# EAGLE design McPiFace-Environment-V2 (EAGLE 7.4.0)
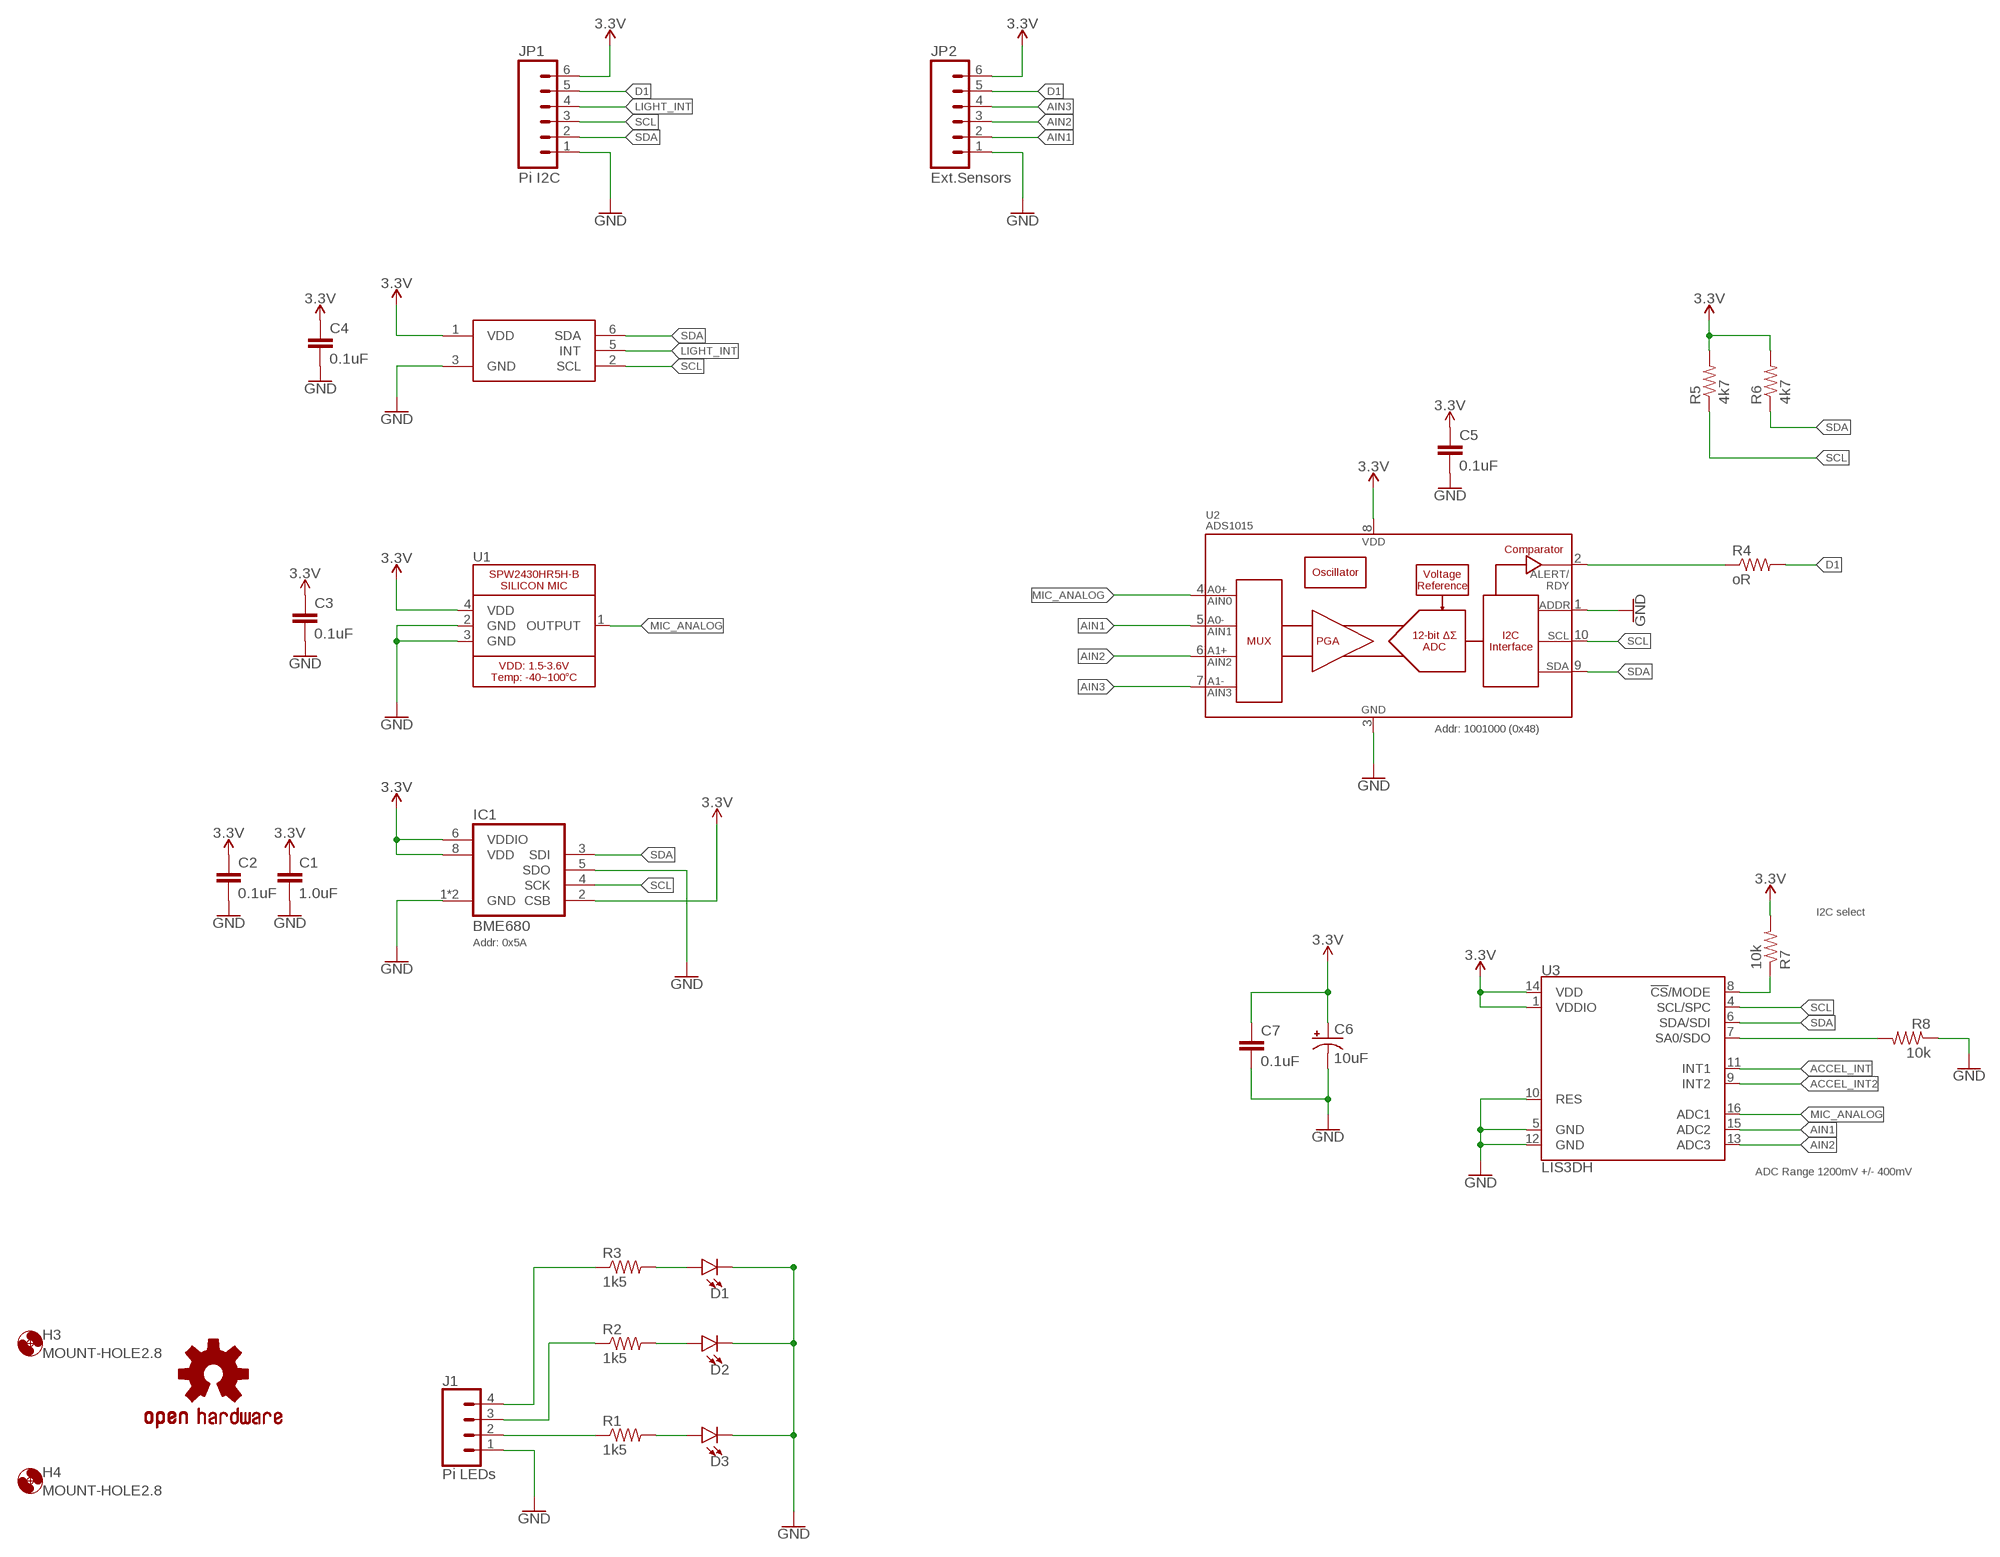
[diagram p0: schematic, sheet 1]

## Parts
C1  1.0uF  CAP0805  [0805]
C2  0.1uF  CAP0805  [0805]
C3  0.1uF  CAP0805  [0805]
C4  0.1uF  CAP0805  [0805]
C5  0.1uF  CAP0805  [0805]
C6  10uF  10UF-16V-10%(TANT)  [EIA3216]
C7  0.1uF  CAP0805  [0805]
D1  LED1206-BOTTOM-1.6MM  [LED-1206-BOTTOM-1.6MM]
D2  LED1206-BOTTOM-1.6MM  [LED-1206-BOTTOM-1.6MM]
D3  LED1206-BOTTOM-1.6MM  [LED-1206-BOTTOM-1.6MM]
H3  MOUNT-HOLE2.8  [2,8]
H4  MOUNT-HOLE2.8  [2,8]
IC1  BME680  [BME680]
J1  Pi LEDs  CONN_04SMD2  [1X04_1MM_RA]
JP1  Pi I2C  M06SMD-1MM  [1X06-1MM]
JP2  Ext.Sensors  M06SMD-1MM  [1X06-1MM]
LOGO1  OSHW-LOGOL  [OSHW-LOGO-L]
R1  1k5  RESISTOR0805-RES  [0805]
R2  1k5  RESISTOR0805-RES  [0805]
R3  1k5  RESISTOR0805-RES  [0805]
R4  oR  RESISTOR0805-RES  [0805]
R5  4k7  RESISTOR0805-RES  [0805]
R6  4k7  RESISTOR0805-RES  [0805]
R7  10k  RESISTOR0805-RES  [0805]
R8  10k  RESISTOR0805-RES  [0805]
U1  SPW2430HR5H-B  [SPW2430HR5H-B]
U2  ADS1015  [MSOP10]
U3  LIS3DH  [LGA-16-3X3]
U$1  TCS3472  [FN-6]

## Nets
3.3V: C1.1 C2.1 C3.1 C4.1 C5.1 C6.A(+) C7.1 IC1.2(CSB) IC1.6(VDDIO) IC1.8(VDD) JP1.6 JP2.6 R5.2 R6.2 R7.2 U1.4(VDD) U2.8(VDD) U3.1(VDDIO) U3.14(VDD) U$1.1(VDD)
ACCEL_INT: U3.11(INT1)
ACCEL_INT2: U3.9(INT2)
AIN1: JP2.2 U2.5(AIN1) U3.15(ADC2)
AIN2: JP2.3 U2.6(AIN2) U3.13(ADC3)
AIN3: JP2.4 U2.7(AIN3)
ALERT: R4.1 U2.2(ALERT/RDY)
D1: JP1.5 JP2.5 R4.2
GND: C1.2 C2.2 C3.2 C4.2 C5.2 C6.C(-) C7.2 D1.C D2.C D3.C IC1.1(GND) IC1.5(SDO) IC1.7(GND) J1.1 JP1.1 JP2.1 R8.1 U1.2(GND) U1.3(GND) U2.1(ADDR) U2.3(VSS) U3.5(GND) U3.10(RES) U3.12(GND) U$1.3(GND)
LIGHT_INT: JP1.4 U$1.5(INT)
MIC_ANALOG: U1.1(OUTPUT) U2.4(AIN0) U3.16(ADC1)
N$2: D1.A R3.2
N$3: D2.A R2.2
N$4: D3.A R1.2
N$5: J1.2 R1.1
N$6: J1.3 R2.1
N$7: J1.4 R3.1
N$14: R8.2 U3.7(SA0/SDO)
N$15: R7.1 U3.8(!CS!/MODE)
SCL: IC1.4(SCK) JP1.3 R5.1 U2.10(SCL) U3.4(SCL/SPC) U$1.2(SCL)
SDA: IC1.3(SDI) JP1.2 R6.1 U2.9(SDA) U3.6(SDA/SDI) U$1.6(SDA)

## Notes on the sheet
- Addr: 1001000 (0x48)
- I2C select
- Addr: 0x5A
- ADC Range 1200mV +/- 400mV

## Library data of the parts
C1-C5 C7 = SparkFun-Capacitors:CAP: Capacitor Standard 0603 ceramic capacitor, and 0.1" leaded capacitor.
C6 = SparkFun-Capacitors:10UF-16V-10%(TANT): CAP-00811 1206/EIA-3216 Tantalum capacitor; PROD_ID: CAP-00811
D1-D3 = ThingySticks:LED: LED (Generic) Standard schematic elements and footprints for 5mm, 3mm, 1206, and 0603 sized LEDs. Generic LEDs with no color specified.
H3 H4 = holes:MOUNT-HOLE: MOUNTING HOLE with drill center marker
IC1 = ThingySticks:BME680: BME680 integrates for the first time individual high linearity and high accuracy sensors for gas, pressure, humidity and temperature. The library has been designed by Richard Magdycz <https://www.facebook.com/groups/eaglecadsoftUK> Original version had pins in incorrect places (BME680 uses untypical clockwise direction). Updated 17 Feb 2018 S.Harrison ThingySticks.com
J1 = SparkFun-Connectors:CONN_04: Multi connection point. Often used as Generic Header-pin footprint for 0.1 inch spaced/style header connections On any of the 0.1 inch spaced packages, you can populate with these: Break Away Headers - Straight <https://www.sparkfun.com/products/116> (PRT-00116) Break Away Male Headers - Right Angle <https://www.sparkfun.com/products/553> (PRT-00553) Female Headers <https://www.sparkfun.com/products/115> (PRT-00115) Break Away Headers - Machine Pin <https://www.sparkfun.com/products/117> (PRT-00117) Break Away Female Headers - Swiss Machine Pin <https://www.sparkfun.com/products/743> (PRT-00743) For SCREWTERMINALS and SPRING TERMINALS visit here: Screw Terimnals on SparkFun.com <https://www.sparkfun.com/search/results?term=Screw+Terminals> (5mm/3.5mm/2.54mm spacing) This device is also useful as a general connection point to wire up your design to another part of your project. Our various solder wires solder well into these plated through hole pads. Hook-Up Wire - Assortment (Stranded, 22 AWG) <https://www.sparkfun.com/products/11375> (PRT-11375) Hook-Up Wire - Assortment (Solid Core, 22 AWG) <https://www.sparkfun.com/products/11367> (PRT-11367) View the entire wire category on our website here <https://www.sparkfun.com/categories/141> Special notes: Molex polarized connector foot print use with SKU : PRT-08231 with associated crimp pins and housings. 1MM SMD Version SKU: PRT-10208; PROD_ID: CONN-10310; SF_ID: PRT-10208
JP1 JP2 = SparkFun-Connectors:M06: Header 6 Standard 6-pin 0.1" header. Use with straight break away headers (SKU : PRT-00116), right angle break away headers (PRT-00553), swiss pins (PRT-00743), machine pins (PRT-00117), and female headers (PRT-00115). Molex polarized connector foot print use with SKU : PRT-08094 with associated crimp pins and housings. NOTES ON THE VARIANTS LOCK and LOCK_LONGPADS... This footprint was designed to help hold the alignment of a through-hole component (i.e. 6-pin header) while soldering it into place. You may notice that each hole has been shifted either up or down by 0.005 of an inch from it's more standard position (which is a perfectly straight line). This slight alteration caused the pins (the squares in the middle) to touch the edges of the holes. Because they are alternating, it causes a "brace" to hold the component in place. 0.005 has proven to be the perfect amount of "off-center" position when using our standard breakaway headers. Although looks a little odd when you look at the bare footprint, once you have a header in there, the alteration is very hard to notice. Also,if you push a header all the way into place, it is covered up entirely on the bottom side. This idea of altering the position of holes to aid alignment will be further integrated into the Sparkfun Library for other footprints. It can help hold any component with 3 or more connection pins.
LOGO1 = SparkFun-Aesthetics:OSHW-LOGO: Open-Source Hardware (OSHW) Logo This logo indicates the piece of hardware it is found on incorporates a OSHW license and/or adheres to the definition of open source hardware found here: http://freedomdefined.org/OSHW
R1-R8 = SparkFun-Resistors:RESISTOR: Resistor Basic schematic elements and footprints for 0603, 1206, and PTH resistors.
U1 = microbuilder:SPW2430HR5H-B: SPW2430HR5H-B - Silicon Microphone
U2 = SparkFun-AnalogIC:ADS1015: 12-Bit Del-Sig ADC Four single-ended inputs or two differential inputs Internal PGA I2C interface 2.0-5.5V; PROD_ID: IC-12239
U3 = SparkFun-Sensors:LIS3DH: ST Microelectronics LIS3DH 3-Axis ±2/4/8/16g SPI/I2C Accelerometer The LIS3DH is a three axis MEMS linear accelerometer in the "nano" family. It has a digital I2C/SPI serial interface which makes it ideal for using in embedded applications. The device also features ultra low-power operational modes that allow advanced power saving and smart sleep to wake-up functions, built in detections with interrupts, and auxiliary ADC inputs Datasheet-XXXX <http://www.sparkfun.com/datasheets/Sensors/Accelerometer/LIS3DH.pdf> SparkFun Products SparkFun Triple Axis Accelerometer Breakout - LIS3DH <https://www.sparkfun.com/products/10345> (SEN-XXXXX) Triple Axis Accelerometer - LIS3DH <https://www.sparkfun.com/products/9755> (SEN-XXXXX); PROD_ID: IC-13419; SF_ID: N/A
U$1 = TCS3472:TCS3472

## Board
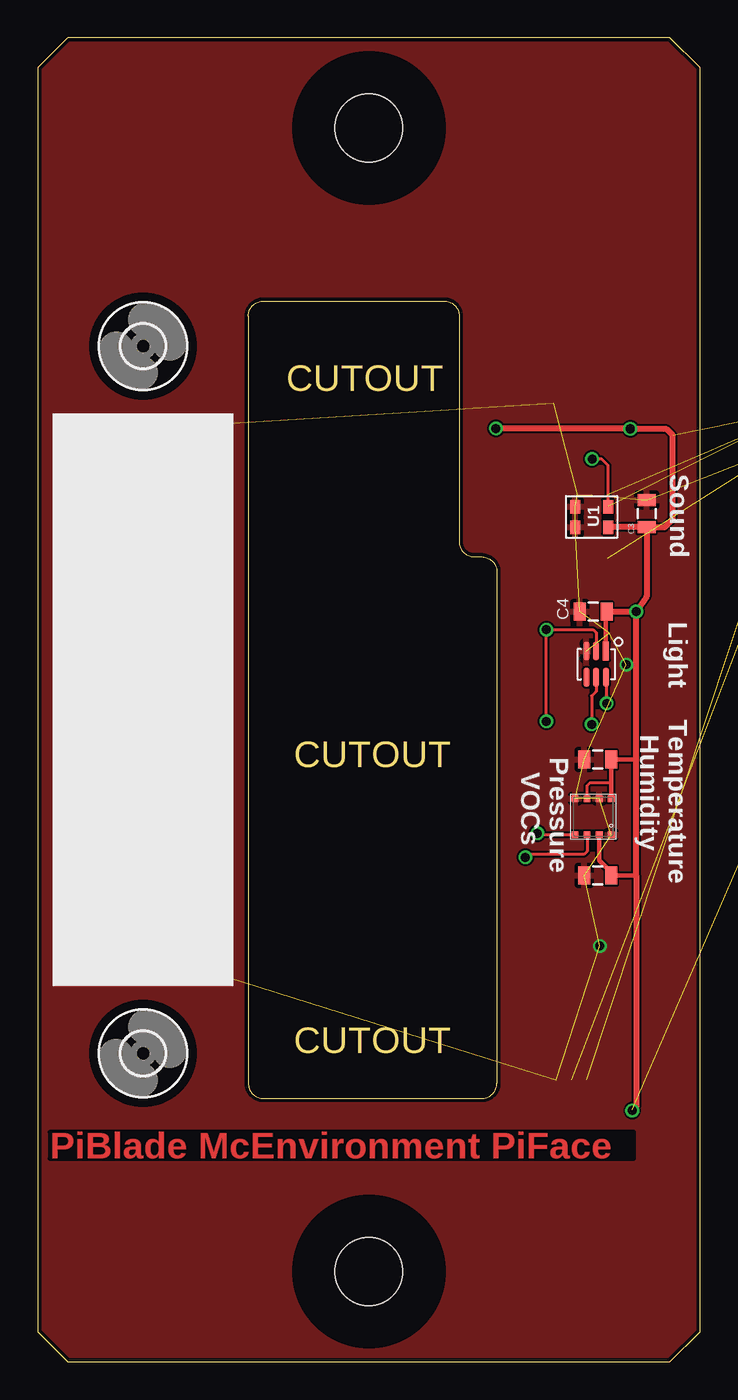
[diagram p1: board, top side]
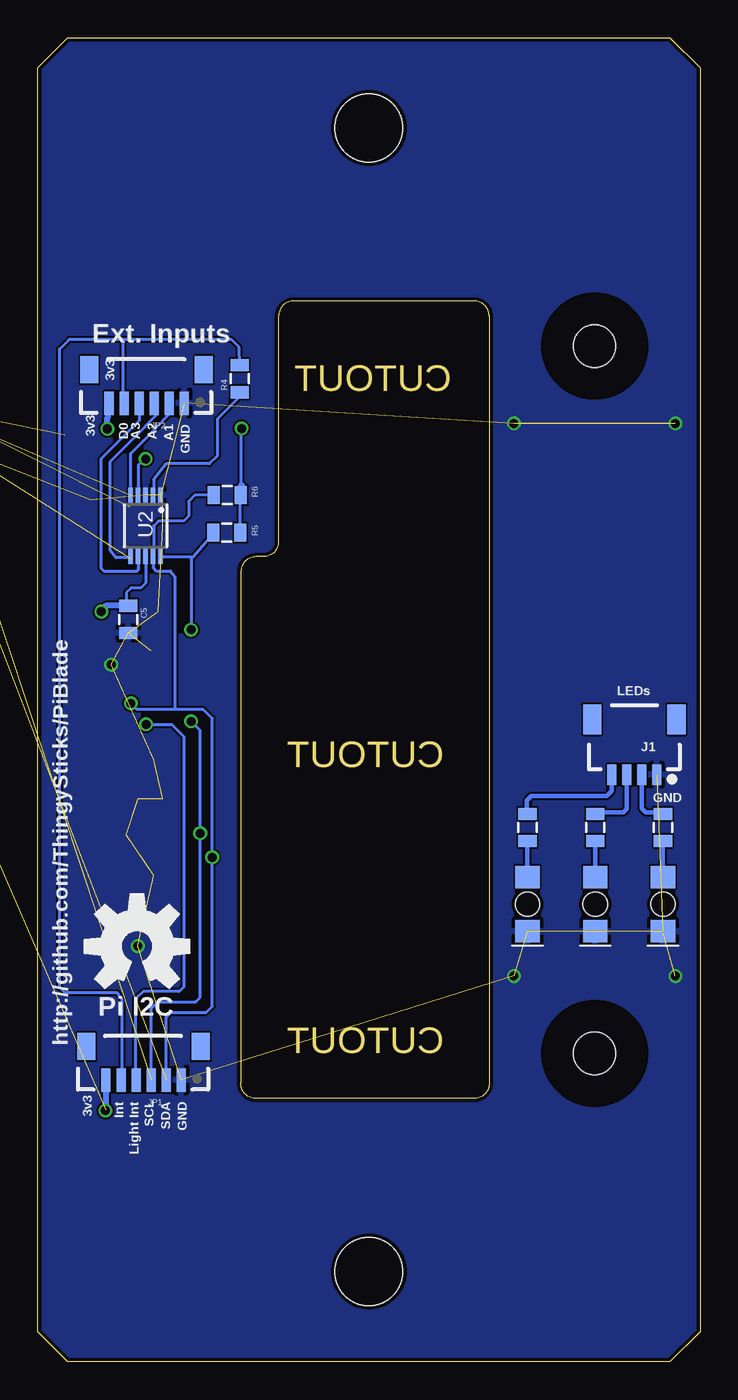
[diagram p2: board, bottom side, seen from below]

Size 44 x 88 mm. Coordinates in mm from the lower left corner, seen from the top.
Outline: 2,0 42,0 44,2 44,86 42,88 2,88 0,86 0,2 2,0
Outline: 14,69.5 14,18.5 arc90 15,17.5 29.5,17.5 arc90 30.5,18.5 30.5,52.5 arc90 29.5,53.5 29,53.5 arc-90 28,54.5 28,69.5 arc90 27,70.5 15,70.5 arc90 14,69.5
Copper layers (1*16): Top 0.035mm / dielectric 1.5mm / Bottom 0.035mm
Design rules "dirt_cheap_dirty_boards.v1": minimum track width 5mil, minimum drill 12mil, track to track 5mil, track to pad 5mil, pad to pad 5mil, via to via 5mil, smd to smd 0mil, copper to edge 10mil, drill to drill 10mil, minimum pad ring 10mil, minimum via ring 6mil, stop-mask expansion 2mil, vias tented up to drill 25mil, thermal gap 10mil
Holes 4.5 mm at 22,6 22,82
tRestrict: area 17,77 to 27,87; area 17,1 to 27,11

### Footprints (pad centres in the part's own frame; a part is rotated, then mirrored left to right if it is on the bottom)
0805 = smd 0.8 x 1.2: 1 -0.9,0; 2 0.9,0
EIA3216 = smd 1.4 x 1.6: A 1.4,0; C -1.4,0
LED-1206-BOTTOM-1.6MM = smd 1.5 x 1.6: A -1.8,0; C 1.8,0 | hole 1.6: 0,0
2,8 = hole 2.8: 0,0
BME680 = smd 0.45 x 0.45: 1 1.2,-1.2; 2 0.4,-1.2; 3 -0.4,-1.2; 4 -1.2,-1.2; 5 -1.2,1.2; 6 -0.4,1.2; 7 0.4,1.2; 8 1.2,1.2
1X04_1MM_RA = smd 0.6 x 1.35: 1 -1.5,0; 2 -0.5,0; 3 0.5,0; 4 1.5,0 | smd 1.2 x 2: NC1 2.8,-3.675; NC2 -2.8,-3.675
1X06-1MM = smd 0.6 x 1.55: 1 -2.54,1.27; 2 -1.54,1.27; 3 -0.54,1.27; 4 0.46,1.27; 5 1.46,1.27; 6 2.46,1.27 | smd 1.2 x 1.8: P$1 -3.84,-0.955; P$2 3.76,-0.955
SPW2430HR5H-B = smd 0.9 x 0.66: 1 -0.675,1.095; 2 -0.675,-1.095; 3 0.675,-1.095; 4 0.675,1.095
MSOP10 = smd 0.3 x 1: 1 -1,-2.05; 2 -0.5,-2.05; 3 0,-2.05; 4 0.5,-2.05; 5 1,-2.05; 6 1,2.05; 7 0.5,2.05; 8 0,2.05; 9 -0.5,2.05; 10 -1,2.05
LGA-16-3X3 = smd 0.7 x 0.28: 1 -1.4,1; 2 -1.4,0.5; 3 -1.4,0; 4 -1.4,-0.5; 5 -1.4,-1; 9 1.4,-1; 10 1.4,-0.5; 11 1.4,0; 12 1.4,0.5; 13 1.4,1 | smd 0.28 x 0.7: 6 -0.5,-1.4; 7 0,-1.4; 8 0.5,-1.4; 14 0.5,1.4; 15 0,1.4; 16 -0.5,1.4
FN-6 = smd 1.25 x 0.4: 1 -0.875,0.65; 2 -0.875,0; 3 -0.875,-0.65; 4 0.875,-0.65; 5 0.875,0; 6 0.875,0.65

### Placement (x,y rotation side)
C1  37.2,40.02 180 top
C2  37.2,32.33 180 top
C3  40.46,56.36 90 top
C4  36.9,49.86 180 top
C5  37.97,49.34 270 bottom
C6  60.7,64.3 90 top  (outside the outline)
C7  63,64.1 270 top  (outside the outline)
D1  11.46,30.42 270 bottom
D2  6.96,30.42 270 bottom
D3  2.46,30.42 270 bottom
H3  7,20.5 0 top
H4  7,67.5 0 top
IC1  36.9,36.23 0 top
J1  4.36,39.02 180 bottom
JP1  37,20 180 bottom
JP2  36.8,64.97 180 bottom
LOGO1  37.4,27.6 0 bottom
R1  2.46,35.52 270 bottom
R2  6.96,35.52 270 bottom
R3  11.46,35.52 270 bottom
R4  30.59,65.33 90 bottom
R5  31.43,55.1 0 bottom
R6  31.4,57.6 0 bottom
R7  55.4,67.5 0 top  (outside the outline)
R8  50.1,70.4 0 top  (outside the outline)
U1  36.8,56.15 270 top
U2  36.83,55.56 180 bottom
U3  52.1,62.3 0 top  (outside the outline)
U$1  37.1,46.36 270 top

### Tracks (layer width: path | path; a pad name or v marks a point on that pad's centre or on a via)
3.3V  (via drill 0.6)  (5 unrouted)
  Top 0.203: IC1.6 36.5,38.3 36.7,38.5 38.1,38.5
  Top 0.305: U$1.1 37.75,49.41 C4.1 | 39.77,40.02 C1.1 38.1,38.5 IC1.8 | IC1.2 37.3,33.33 38.1,32.52 C2.1 39.76,32.33
  Top 0.406: v39.77,49.86 39.77,40.02 39.76,32.33 39.76,16.96 v39.5,16.7 | C3.1 37.91,55.46 U1.4 | v30.45,62.03 30.71,62 v39.37,62 39.49,61.98 41.78,61.98 42.18,61.58 42.18,56 41.65,55.46 C3.1 | C4.1 v39.77,49.86 | C3.1 40.46,50.87 v39.77,49.86
  Bottom 0.203: U2.8 36.83,51.75 37.15,51.44 37.78,51.44 38.1,51.12 38.1,50.37 C5.1 | R5.2 30.54,58.16 R6.2 | 30.4,58.1 R6.2 | v30.45,62.03 30.49,61.99 30.49,58.26 30.49,58.21 R6.2
  Bottom 0.305: v39.37,62 39.33,62.8 JP2.6
  Bottom 0.406: JP1.6 39.46,16.74 v39.5,16.7 | v39.37,62 39.37,62.76 39.33,62.8 | 30.49,58.26 30.44,58.26 | C5.1 39.48,50.24 v39.77,49.86
AIN1  (1 unrouted)
  Bottom 0.203: U2.5 37.83,60.37 37,61.2 36.13,62.1 35.3,62.94 35.3,63.66
  Bottom 0.305: 35.3,63.66 JP2.2
AIN2  (1 unrouted)
  Bottom 0.203: U2.6 37.83,53.38 38.2,53.45 38.8,53.45 39.2,53.95 39.2,59.8 36.99,62.01 36.73,62.31 36.16,62.88 JP2.3
AIN3
  Bottom 0.203: JP2.4 37.26,62.54 39.8,60 39.8,52.75 39.6,52.55 37.4,52.55 37.3,52.65 37.33,52.68 U2.7
ALERT
  Bottom 0.203: R4.1 30.6,64.12 32.07,62.65 32.07,60.21 32.59,59.68 35.45,59.68 36.3,58.63 36.3,57.64 U2.2
D1
  Bottom 0.203: 38.4,18.79 JP1.5 38.42,18.77 38.42,24.13 38.73,24.54 42.2,24.54 42.55,24.88 42.55,67.31 41.91,67.94 38.42,67.94 | R4.2 30.61,67.44 31.11,67.94 38.42,67.94 | JP2.5 38.3,63.74 38.3,67.83 38.42,67.94
GND  (via drill 0.6, 0.6 pad 0.25)  (30 unrouted)
  other vias: 1.64,62.37 12.37,62.37 1.64,25.64 12.37,25.64 39.11,46.34 37.35,27.63
  pour Top: -1,88.5 45,88.5 45,-1 -1,-1
  pour Bottom: -1,88.5 45,88.5 45,-1 -1,-1
LIGHT_INT  (via drill 0.6)
  Top 0.203: U$1.5 37.1,44.56 36.8,44.26 v36.8,42.36
  Bottom 0.203: v36.8,42.36 35.1,42.36 34.3,41.56 34.3,24.92 34.6,24.62 37,24.62 37.5,24.12 37.5,18.77
  Bottom 0.305: 37.5,18.77 JP1.4
MIC_ANALOG  (via drill 0.6)  (1 unrouted)
  Top 0.203: U1.1 37.9,59.58 37.47,60.01 v36.83,60.01
  Bottom 0.203: v36.83,60.01 36.89,60.01 37.3,59.6 37.3,57.64 U2.4
N$2
  Bottom 0.305: D1.A R3.2
N$3
  Bottom 0.305: D2.A R2.2
N$4
  Bottom 0.305: D3.A R1.2
N$5
  Bottom 0.305: J1.2 3.86,36.76 3.6,36.5 2.54,36.5 R1.1
N$6
  Bottom 0.305: J1.3 4.86,36.74 5.1,36.5 6.84,36.5 R2.1
N$7
  Bottom 0.305: J1.4 5.86,37.94 6.2,37.6 11.2,37.6 11.5,37.3 11.5,36.46 R3.1
N$14  (1 unrouted)
N$15  (1 unrouted)
SCL  (via drill 0.6)  (1 unrouted)
  Top 0.203: v33.8,42.56 v33.8,48.66 36.9,48.66 37.1,48.46 U$1.2 | IC1.4 33.3,35.02 v33.2,35.12
  Bottom 0.203: JP1.3 36.46,23.49 36.02,23.93 33.5,23.93 33.2,24.23 v33.2,35.12 33.2,41.96 v33.8,42.56 | U2.10 33.66,53.51 | 33.66,53.51 32.85,54.47 32.38,54.93 32.28,55.05 R5.1 | v33.8,48.66 33.8,53.37 33.66,53.51
SDA  (via drill 0.6)  (1 unrouted)
  Top 0.203: v37.8,43.76 37.8,45.44 | IC1.3 36.5,33.92 36.3,33.73 32.6,33.73 v32.4,33.52
  Top 0.305: 37.8,45.44 U$1.6
  Bottom 0.203: JP1.2 35.46,22.89 35.12,23.23 32.8,23.23 32.4,23.64 v32.4,33.52 32.4,42.76 33,43.36 34.92,43.36 | 34.92,43.36 37.4,43.36 v37.8,43.76 | 34.92,43.36 34.9,43.38 34.9,52.18 35.18,52.56 36.12,52.56 36.33,52.78 U2.9 36.3,53.54 36.3,55.55 35.97,55.88 34.29,55.88 33.97,56.2 33.97,57.19 33.56,57.6 R6.1

### Text on the board
Top: PiBlade McEnvironment PiFace
Dimension: CUTOUT | CUTOUT | CUTOUT
tNames: Sound | Light | Temperature / Humidity | Pressure / VOCs
bNames: Ext. Inputs | 3v3 | 3v3 | GND | A1 | A2 | A3 | D0 | http://github.com/ThingySticks/PiBlade | LEDs | GND | Pi I2C | 3v3 | GND | SDA | SCL | Light Int | Int